# EAGLE schematic nomad (EAGLE 7.7.0)
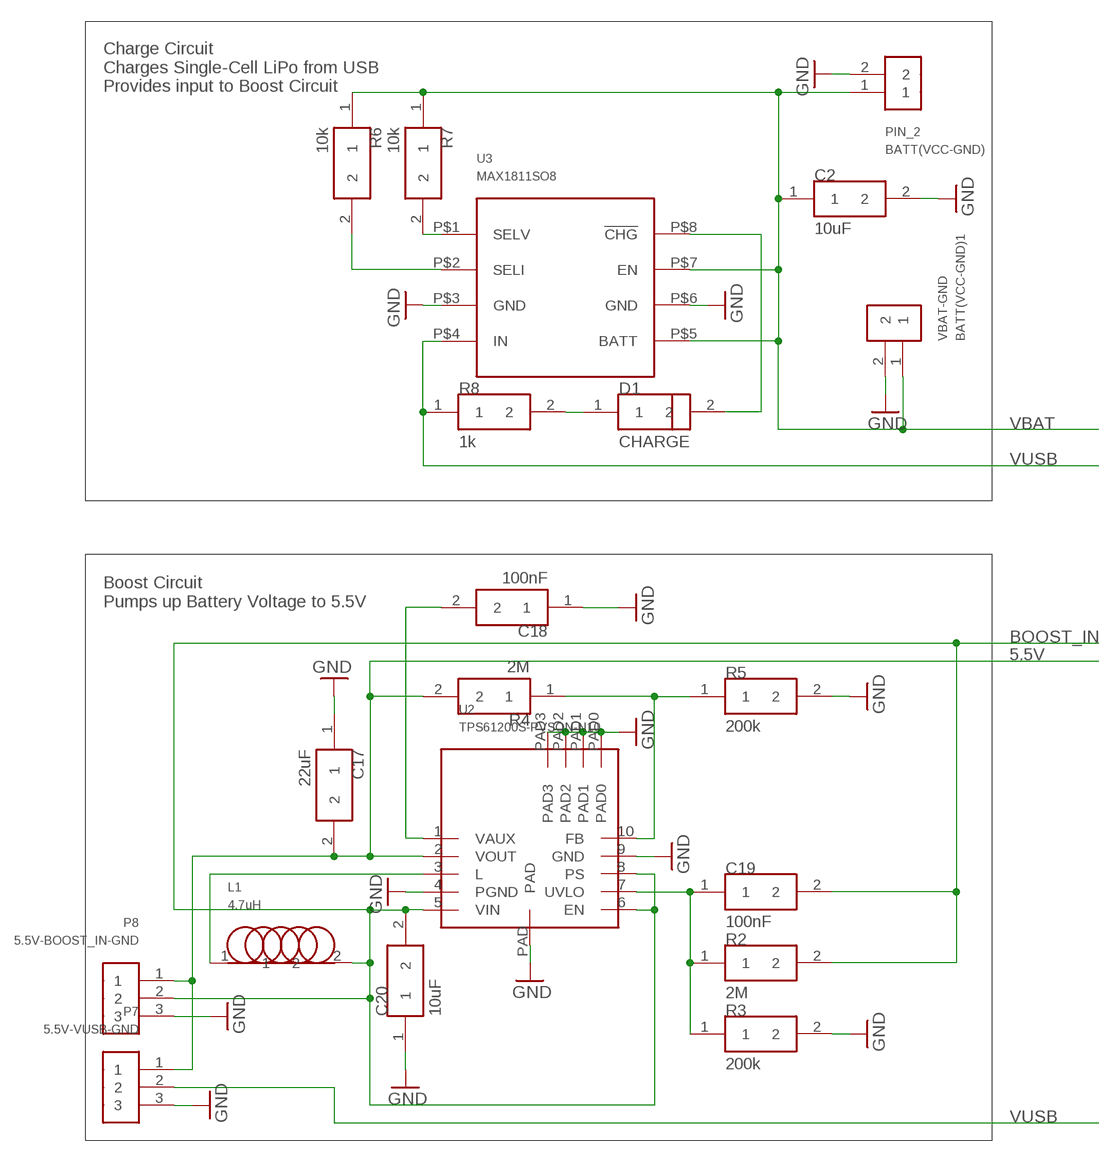
[diagram p0: schematic, sheet 1]

## Parts
BATT(VCC-GND)  PIN_2  [PIN_2]
BATT(VCC-GND)1  VBAT-GND  PIN_2  [PIN_2]
C2  10uF  CAP0805  [0805]
C17  22uF  CAP1206  [1206]
C18  100nF  CAP0805  [0805]
C19  100nF  CAP0805  [0805]
C20  10uF  CAP0805  [0805]
D1  CHARGE  LED0805  [0805]
L1  4.7uH  INDSMD-3232  [IND-SMD-3232]
P7  5.5V-VUSB-GND  PIN_3  [PIN_3]
P8  5.5V-BOOST_IN-GND  PIN_3  [PIN_3]
R2  2M  RES0805  [0805]
R3  200k  RES0805  [0805]
R4  2M  RES0805  [0805]
R5  200k  RES0805  [0805]
R6  10k  RES0805  [0805]
R7  10k  RES0805  [0805]
R8  1k  RES0805  [0805]
U2  TPS61200S-PVSON-N10  [S-PVSON-N10]
U3  MAX1811SO8  [SO8]

## Nets
5.5V: C17.2 P7.1 P8.1 R4.2 U2.2(VOUT)
BOOST_IN: C19.2 C20.2 L1.2 P8.2 R2.2 U2.5(VIN) U2.6(EN) U2.8(PS)
GND: BATT(VCC-GND)1.2 BATT(VCC-GND).2 C2.2 C17.1 C18.1 C20.1 P7.3 P8.3 R3.2 R5.2 U2.4(PGND) U2.9(GND) U2.PAD U2.PAD0 U2.PAD1 U2.PAD2 U2.PAD3 U3.P$3(GND) U3.P$6(GND)
N$13: C19.1 R2.1 R3.1 U2.7(UVLO)
N$14: R4.1 R5.1 U2.10(FB)
N$15: C18.2 U2.1(VAUX)
N$16: L1.1 U2.3(L)
N$17: D1.2 U3.P$8(!CHG)
N$18: D1.1 R8.2
N$19: R7.2 U3.P$1(SELV)
N$20: R6.2 U3.P$2(SELI)
VBAT: BATT(VCC-GND)1.1 BATT(VCC-GND).1 C2.1 R6.1 R7.1 U3.P$5(BATT) U3.P$7(EN)
VUSB: P7.2 R8.1 U3.P$4(IN)

## Notes on the sheet
- Charge Circuit
  Charges Single-Cell LiPo from USB
  Provides input to Boost Circuit
- Boost Circuit
  Pumps up Battery Voltage to 5.5V

## Library data of the parts
BATT(VCC-GND) BATT(VCC-GND)1 = dooba:PIN_2
C2 C17-C20 = dooba:CAP
D1 = dooba:LED
L1 = dooba:IND
P7 P8 = dooba:PIN_3
R2-R8 = dooba:RES
U2 = dooba:TPS61200
U3 = dooba:MAX1811